# EAGLE design LM317T_Var_Sup (EAGLE 7.5.0)
CNAME: Variable Supply with LM317T; DESIGNER: Eng. Mahmoud Karam
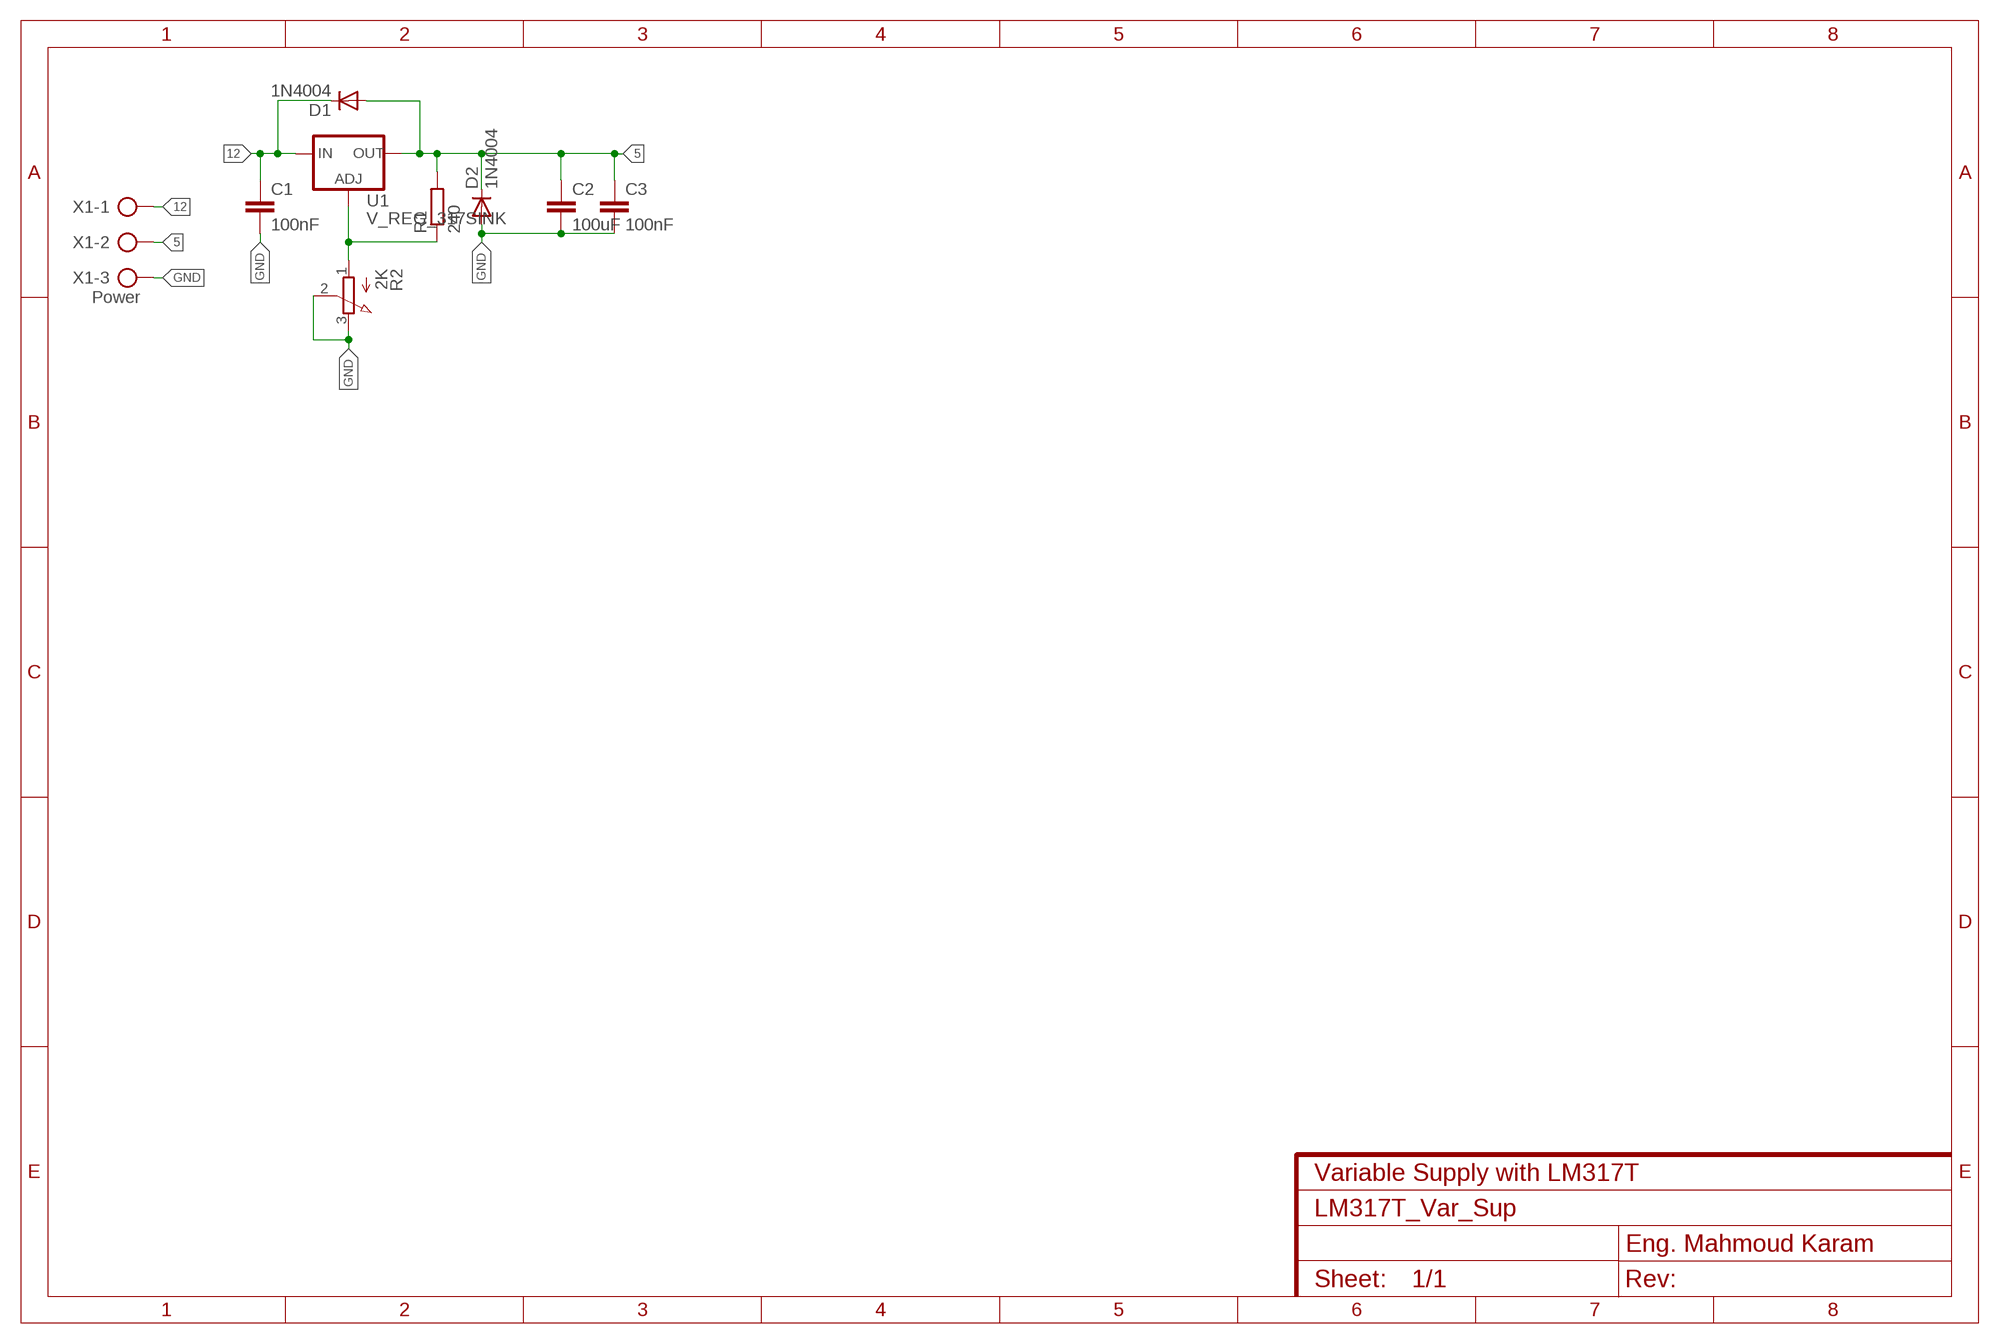
[diagram p0: schematic, sheet 1]

## Parts
C1  100nF  C2.5/2  [C2.5-2]
C2  100uF  C5/5  [C5B5]
C3  100nF  C2.5/2  [C2.5-2]
D1  1N4004  [DO41-10]
D2  1N4004  [DO41-10]
R1  240  R-EU_0207/7  [0207/7]
R2  2K  3RP/1610N  [3RP/1610N]
U1  V_REG_317SINK  [TO220-ADJ]
X1  Power  AK500/3-H  [AK500/3-H]

## Nets
5: C2.1 C3.1 D1.A D2.C R1.2 U1.OUT X1.2
12: C1.1 D1.C U1.IN X1.1
GND: C1.2 C2.2 C3.2 D2.A R2.2(S) R2.3(E) X1.3
N$3: R1.1 R2.1(A) U1.ADJ

## Library data of the parts
C1-C3 = capacitor-wima:C: CAPACITOR naming: grid - package width
D1 D2 = diode:1N4004: DIODE general purpose rectifier, 1 A
R1 = resistor:R-EU_: RESISTOR, European symbol
R2 = pot:3RP/1610N: 16mm Potentiometer one level Source: http://www.alphapotentiometers.net/html/16mm_pot_2.html
U1 = SparkFun-IC-Power:V_REG_317: Voltage Regulator Standard LM317 adjustable voltage regulator. AOI (Adjust Output Input). Google 'LM317 Calculator' for easy to use app to get the two resistor values needed. 240/720 for 5V output. 240/390 for 3.3V output. Spark Fun Electronics SKU : COM-00527
X1 = con-ptr500:AK500/3-H: CONNECTOR Aug. 2004 / PTR Meßtechnik: Die Bezeichnung der Serie AK505 wurde geändert. Es handelt sich hierbei um AK500 in horizontaler Ausführung.; OC_FARNELL: unknown; OC_NEWARK: unknown

## Board
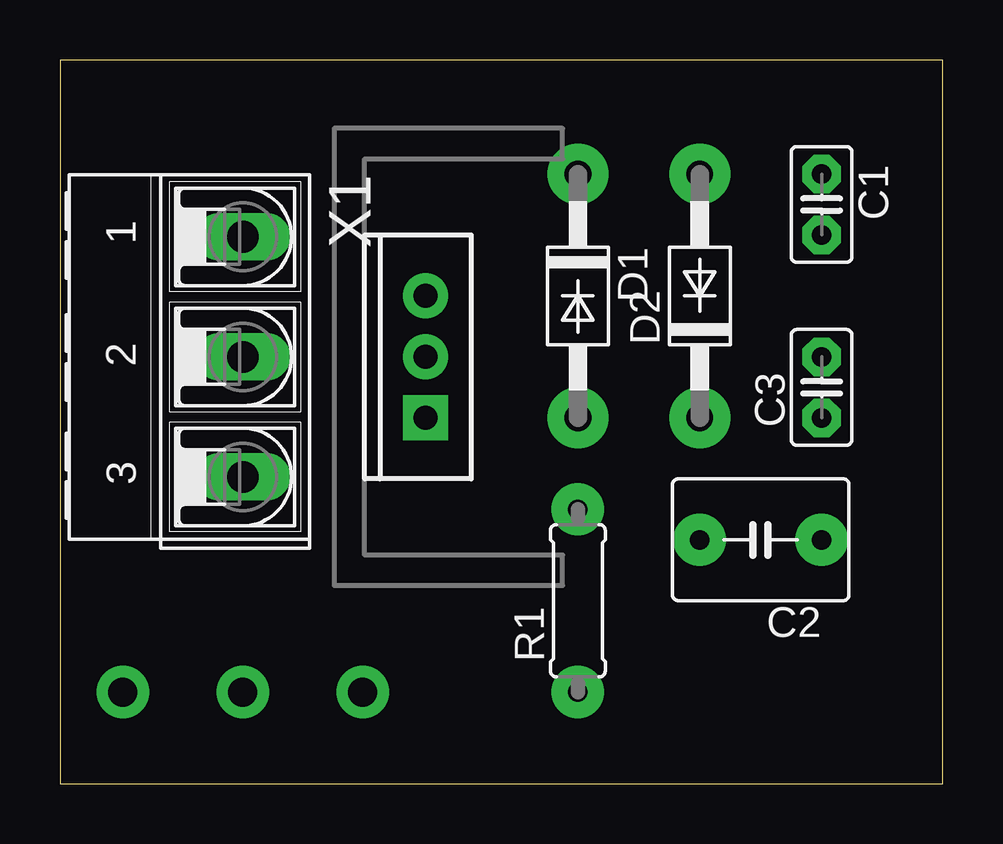
[diagram p1: board, top side]
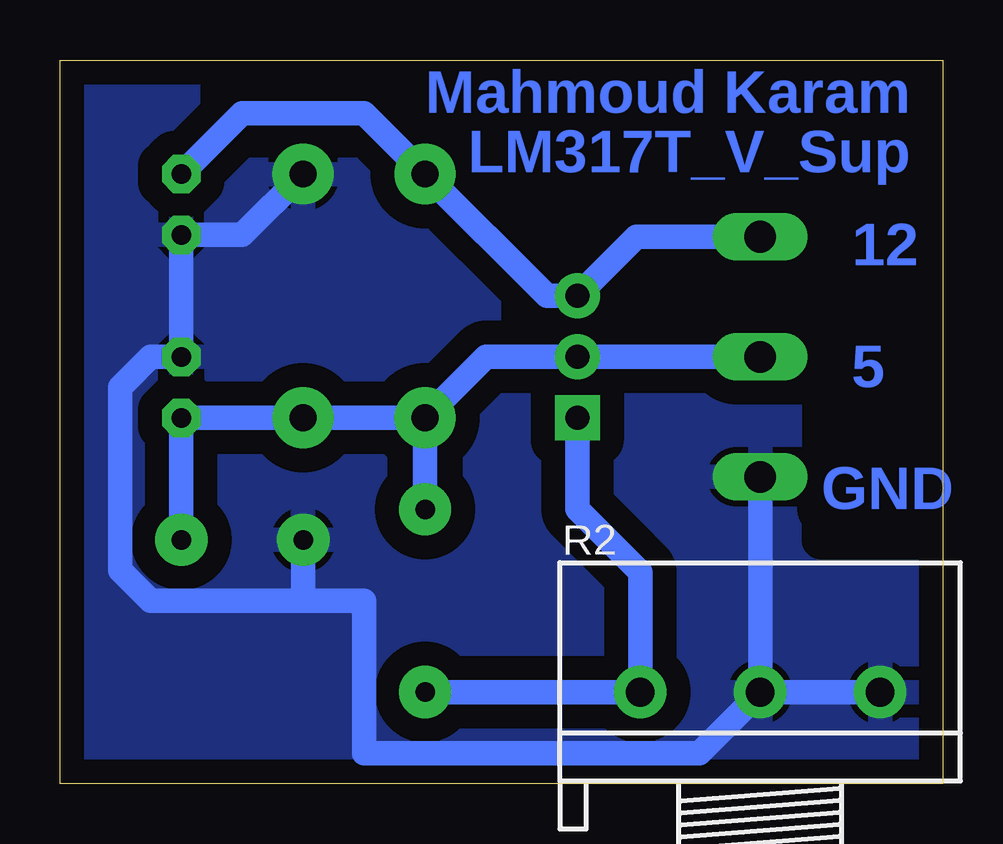
[diagram p2: board, bottom side, seen from below]

Size 36.81 x 30.15 mm. Coordinates in mm from the lower left corner, seen from the top.
Outline: 0,0 36.81,0 36.81,30.15 0,30.15 0,0
Copper layers (1*16): Top 0.035mm / dielectric 1.5mm / Bottom 0.035mm
Design rules "default": minimum track width 1mm, minimum drill 0.2mm, track to track 1mm, track to pad 1mm, pad to pad 1mm, via to via 1mm, smd to smd 8mil, copper to edge 1mm, drill to drill 1mm, minimum pad ring 10mil, minimum via ring 8mil, stop-mask expansion 4mil, vias tented up to drill 0mil, thermal gap 10mil
bRestrict: 2 lines

### Footprints (pad centres in the part's own frame; a part is rotated, then mirrored left to right if it is on the bottom)
C2.5-2 = drill 0.813 pad 1.6 octagon: 1 -1.27,0; 2 1.27,0
C5B5 = drill 0.813 pad 2.184: 1 -2.54,0; 2 2.54,0
DO41-10 = drill 1.118 pad 2.54: A 5.08,0; C -5.08,0
0207/7 = drill 0.813 pad 2.184: 1 -3.81,0; 2 3.81,0
3RP/1610N = drill 1.2 pad 2.184: 1 -5,0; 2 0,0; 3 5,0
TO220-ADJ = drill 1 pad 1.88 square: ADJ -2.54,0 | drill 1 pad 1.88: IN 2.54,0; OUT 0,0
AK500/3-H = drill 1.321 long: 1 -5.004,0; 2 0,0; 3 5.004,0

### Placement (x,y rotation side)
C1  31.75,24.13 270 top
C2  29.21,10.16 180 top
C3  31.75,16.51 90 top
D1  21.59,20.32 270 top
D2  26.67,20.32 90 top
R1  21.59,7.62 90 top
R2  7.62,3.81 0 bottom
U1  15.24,17.78 90 top
X1  7.62,17.78 270 top

### Tracks (layer width: path | path; a pad name or v marks a point on that pad's centre or on a via)
5
  Bottom 1.016: X1.2 U1.OUT 19.05,17.78 D1.A | D1.A R1.2 | D1.A D2.C C3.1 C2.1
12
  Bottom 1.016: X1.1 12.78,22.78 U1.IN 16.51,20.32 D1.C 24.13,27.94 29.21,27.94 C1.1
GND
  Bottom 1.016: X1.3 R2.2 | R2.2 R2.3 | D2.A 29.21,22.86 C1.2 C3.2 33.02,17.78 34.29,16.51 34.29,8.89 33.02,7.62 26.67,7.62 | C2.2 26.67,7.62 | 26.67,7.62 24.13,7.62 24.13,1.27 10.16,1.27 R2.2
  pour Bottom (isolate 0.305): 0,30.48 0,0 36.83,0 36.83,30.48
N$3
  Bottom 1.016: U1.ADJ 15.24,11.43 12.62,8.81 R2.1 R1.1

### Text on the board
Bottom: Mahmoud Karam | LM317T_V_Sup | 12 | 5 | GND